# Altium schematic sheet MIcroSD_Card.SchDoc
size A4; SheetNumber: 5; SheetTotal: 14
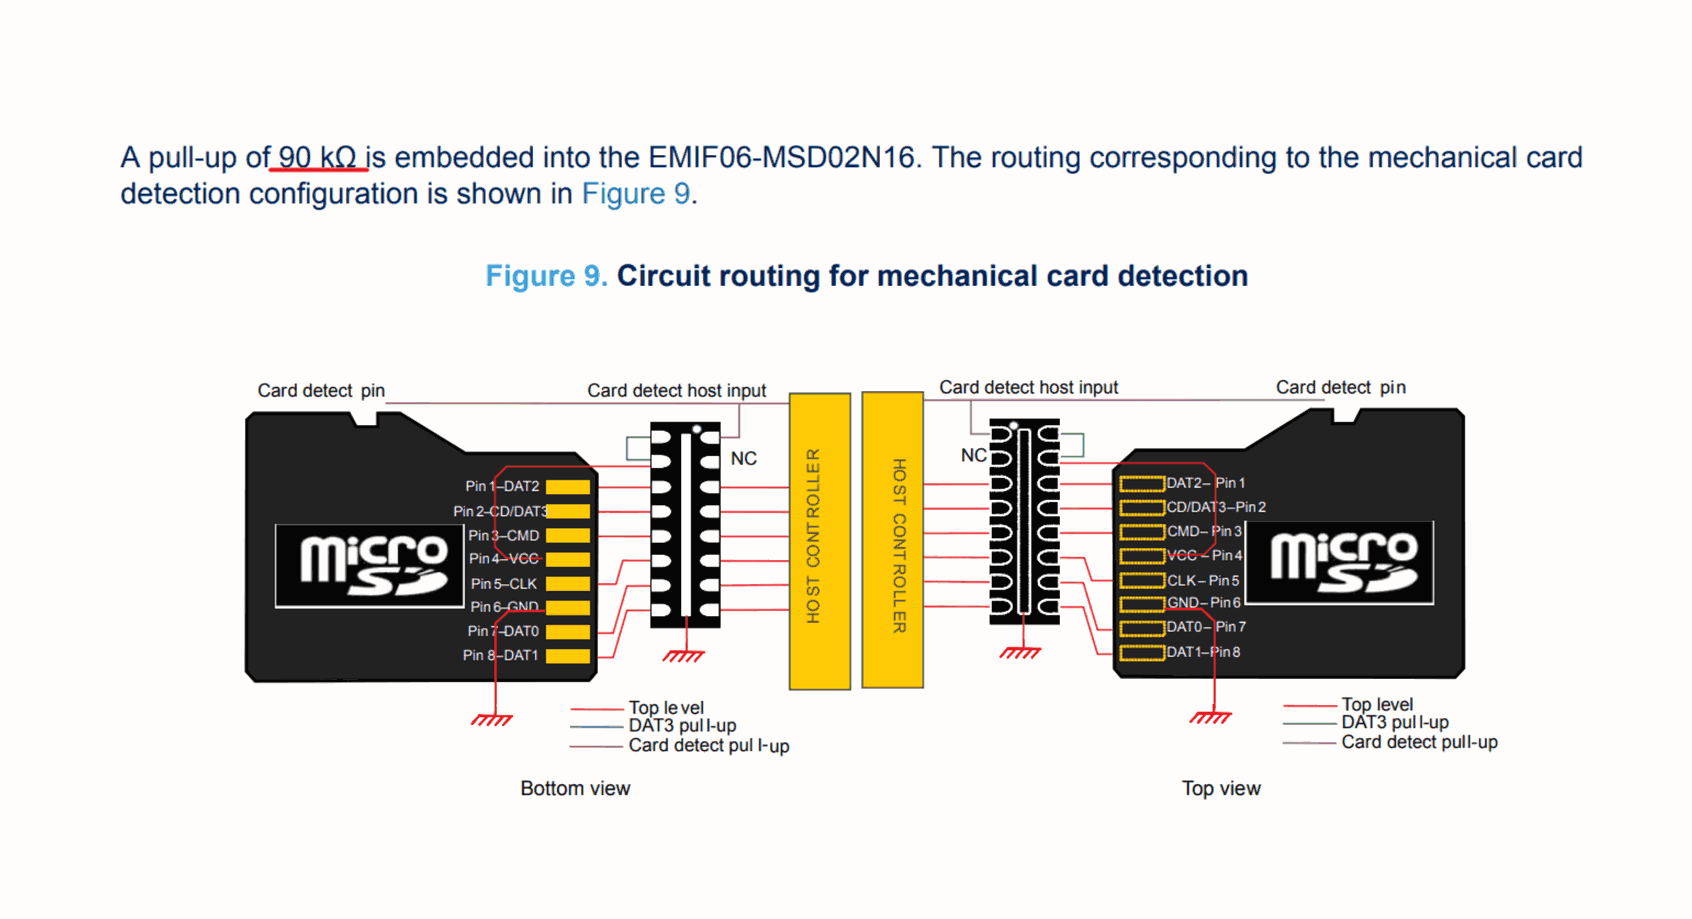
[diagram p0: MIcroSD_Card.SchDoc, top left]
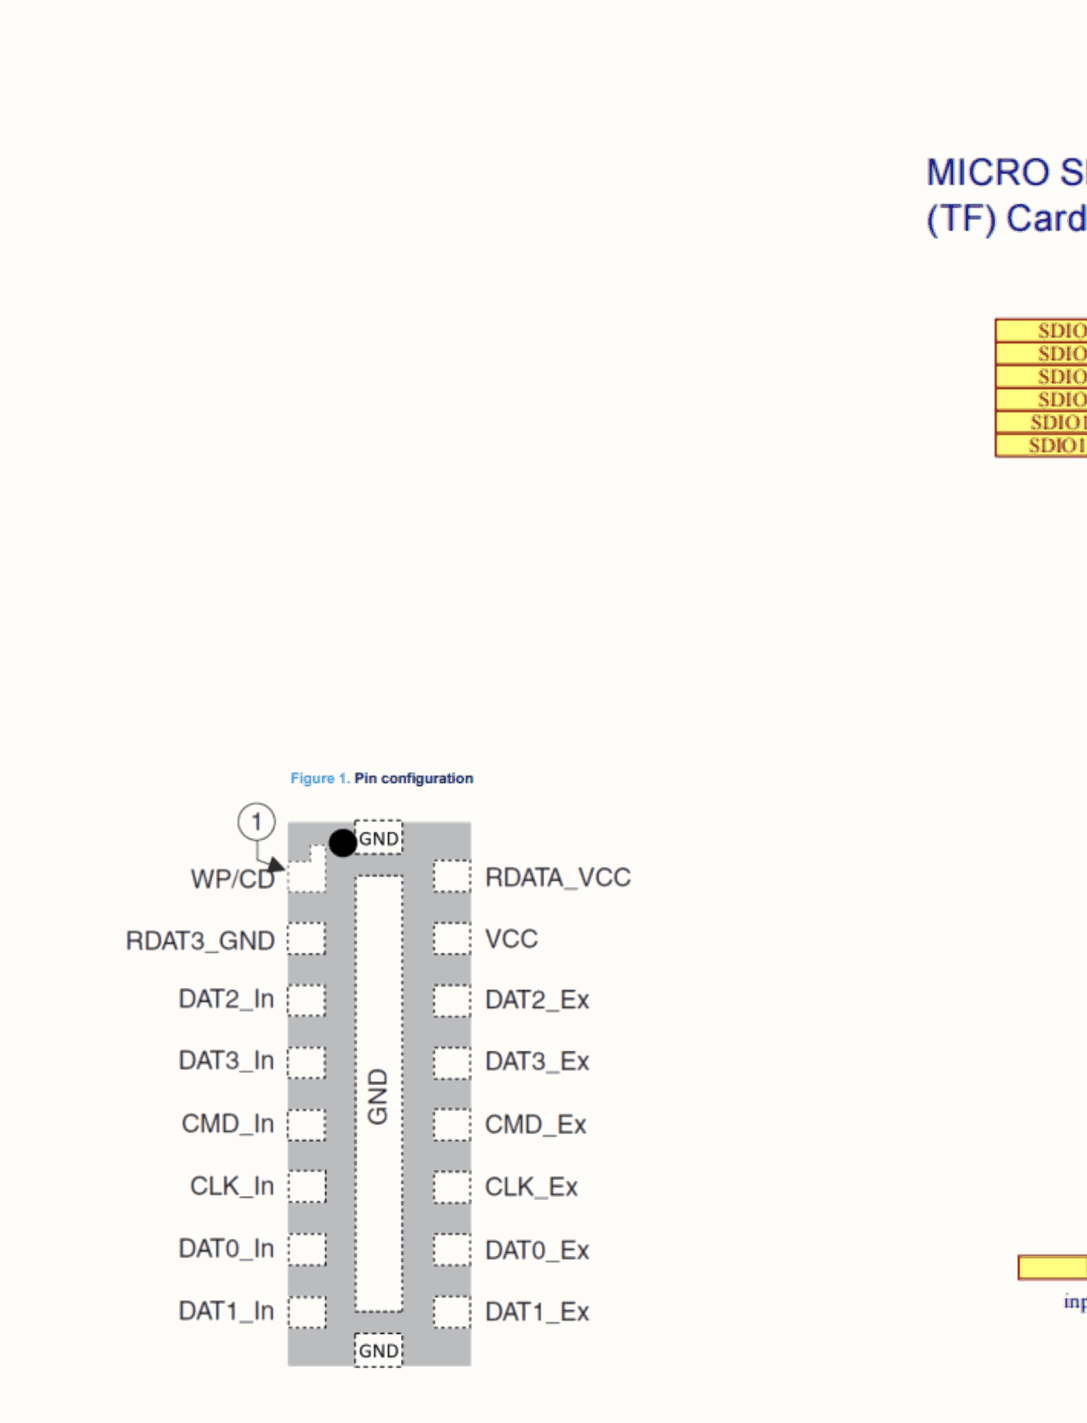
[diagram p1: MIcroSD_Card.SchDoc, top middle]
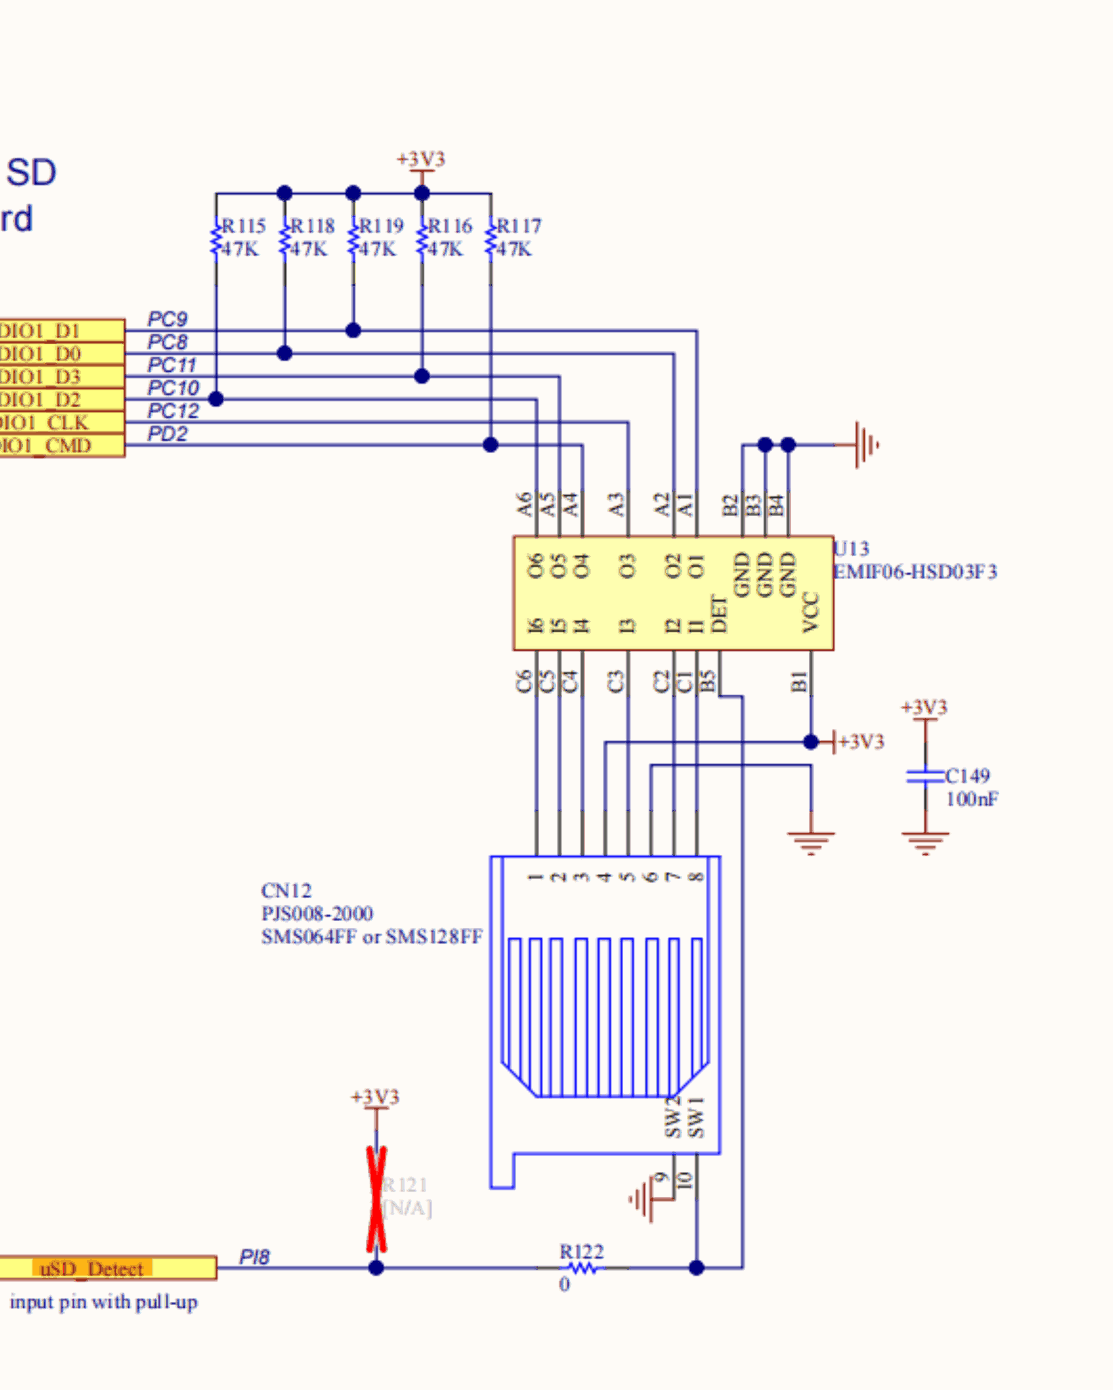
[diagram p2: MIcroSD_Card.SchDoc, top right]
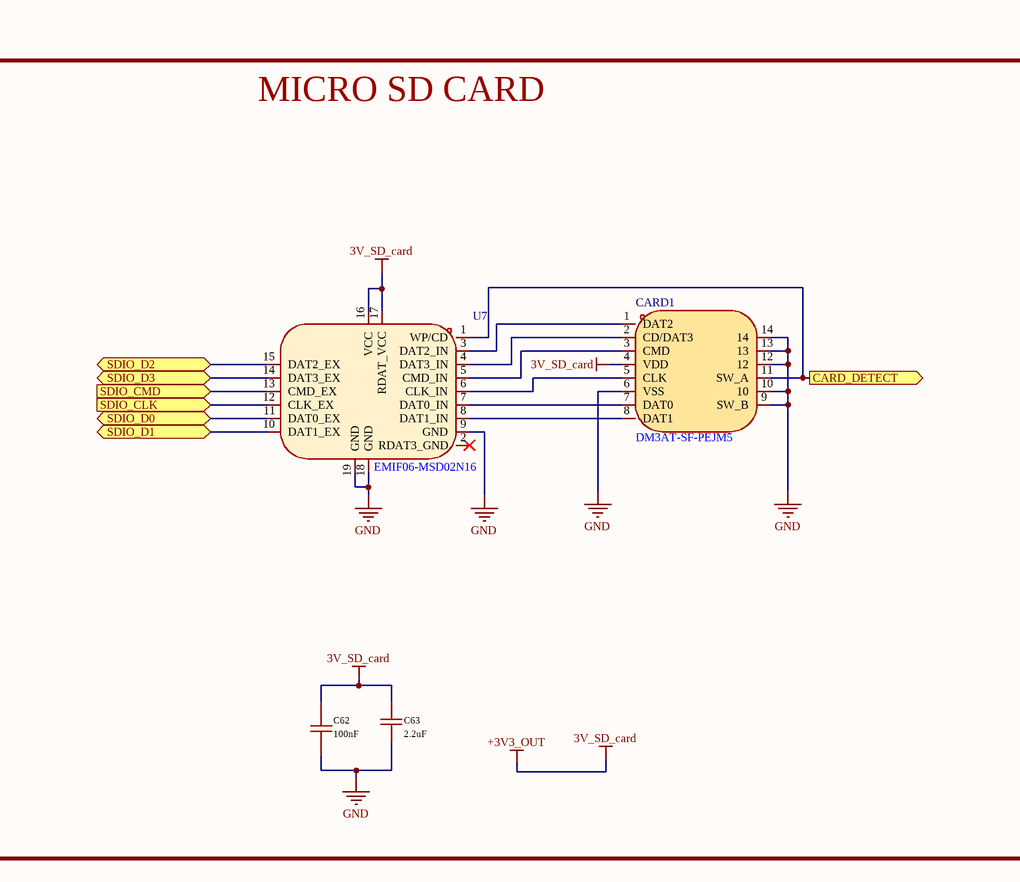
[diagram p3: MIcroSD_Card.SchDoc, bottom left]
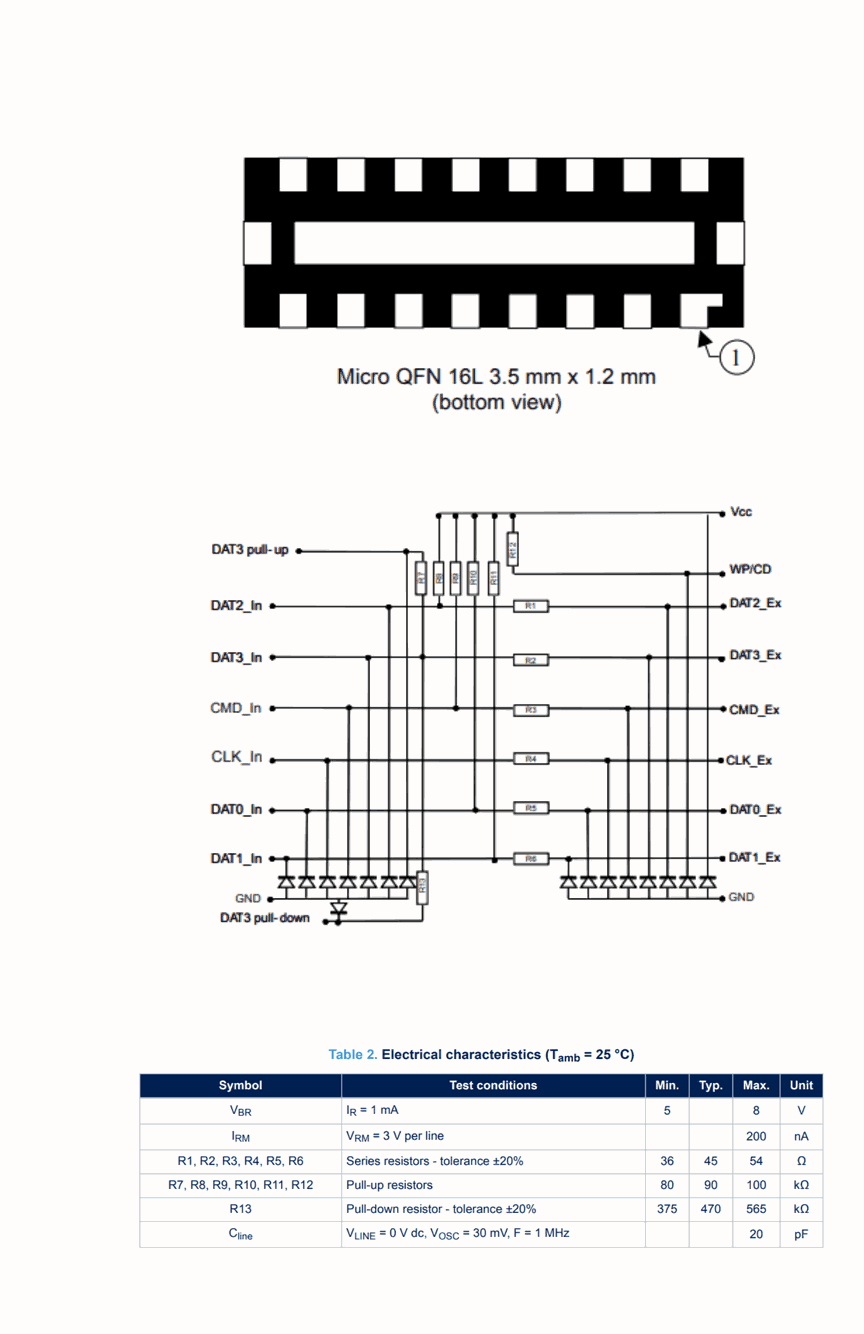
[diagram p4: MIcroSD_Card.SchDoc, bottom middle]
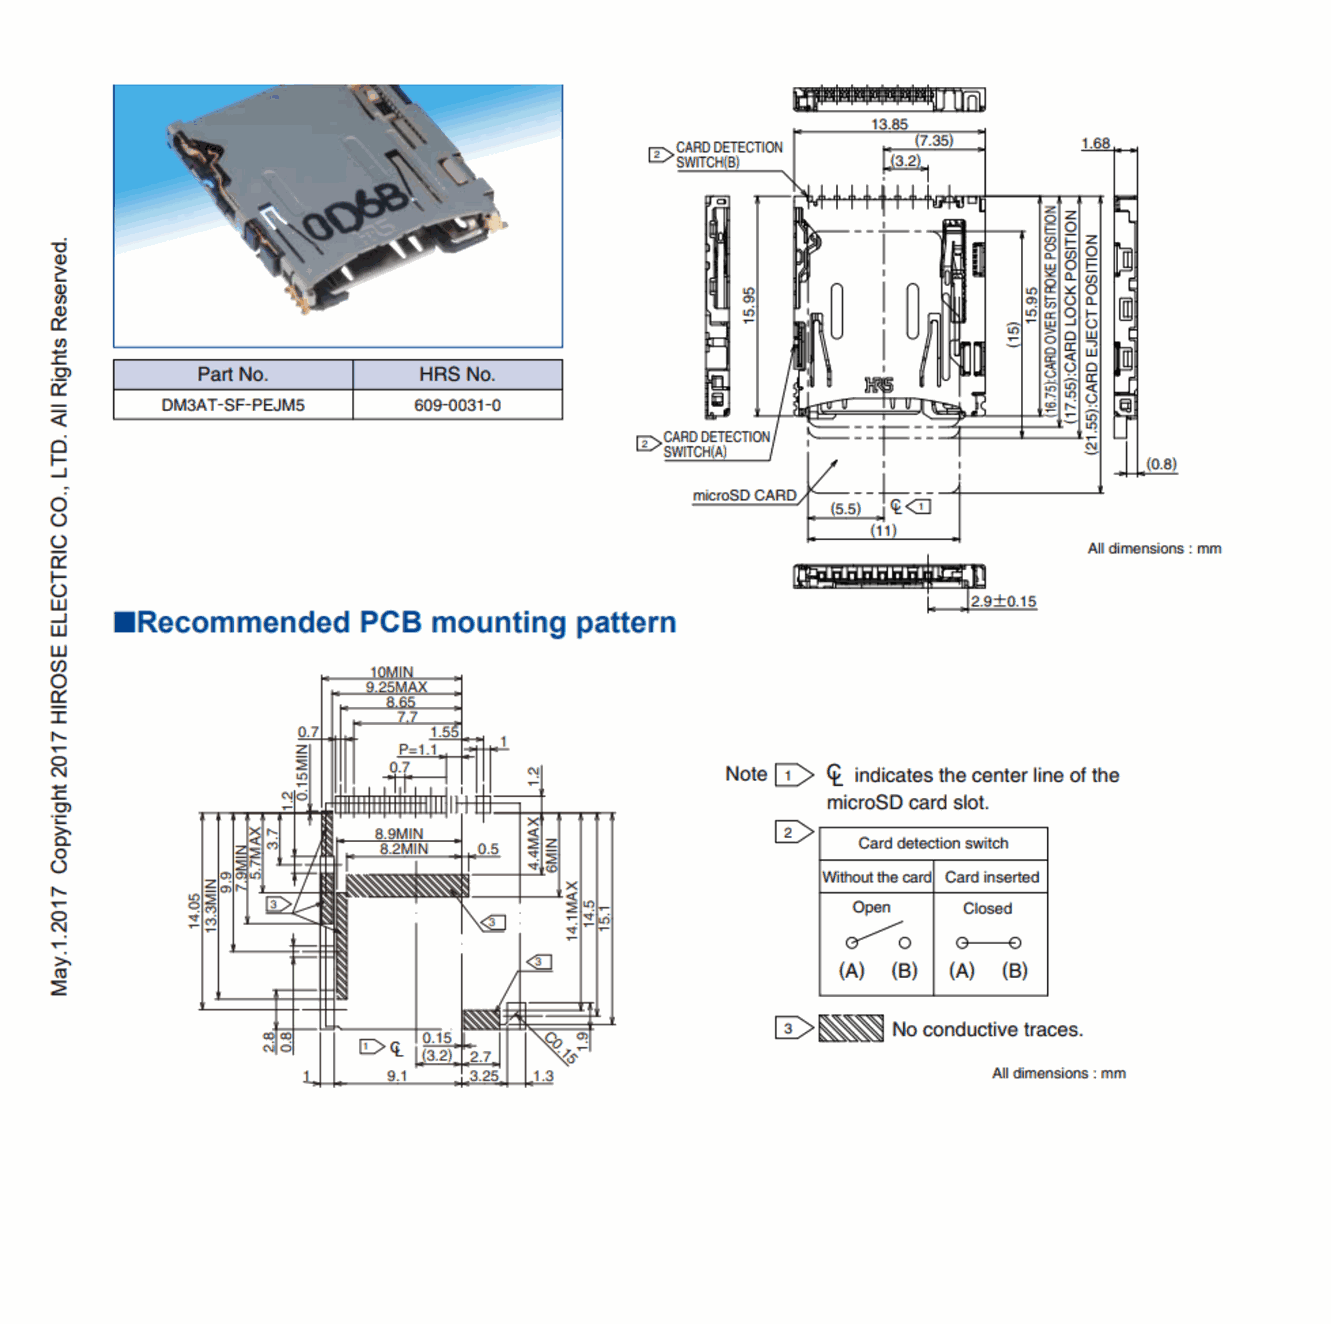
[diagram p5: MIcroSD_Card.SchDoc, bottom right]

## Parts
C62  100nF  [C_0603]
C63  2.2uF  [C_0805]
CARD1  DM3AT-SF-PEJM5  [SD-SMD_DM3AT-SF-PEJM5]
U7  EMIF06-MSD02N16  [QFN-16L_L3.5-W1.2-P0.40_EMIF06-MSD02N16]

## Blocks framed on the sheet
MICRO SD CARD: C62 C63 CARD1 U7

## Ports
CARD_DETECT (out), SDIO_CLK (in), SDIO_CMD (in), SDIO_D0 (bidir), SDIO_D1 (bidir), SDIO_D2 (bidir), SDIO_D3 (bidir)

## Nets
+3V3_OUT: C62.1 C63.2 CARD1.4(VDD) U7.16(VCC) U7.17(RDAT_VCC)  [also labelled 3V_SD_card]
GND: C62.2 C63.1 CARD1.6(VSS) CARD1.9(SW_B) CARD1.10 CARD1.12 CARD1.13 CARD1.14 U7.9(GND) U7.18(GND) U7.19(GND)
CARD_DETECT: CARD1.11(SW_A) U7.1(WP/CD) ; port CARD_DETECT
SDIO_CLK: U7.12(CLK_EX) ; port SDIO_CLK
SDIO_CMD: U7.13(CMD_EX) ; port SDIO_CMD
SDIO_D0: U7.11(DAT0_EX) ; port SDIO_D0
SDIO_D1: U7.10(DAT1_EX) ; port SDIO_D1
SDIO_D2: U7.15(DAT2_EX) ; port SDIO_D2
SDIO_D3: U7.14(DAT3_EX) ; port SDIO_D3
NetCARD1_1: CARD1.1(DAT2) U7.3(DAT2_IN)
NetCARD1_2: CARD1.2(CD/DAT3) U7.4(DAT3_IN)
NetCARD1_3: CARD1.3(CMD) U7.5(CMD_IN)
NetCARD1_5: CARD1.5(CLK) U7.6(CLK_IN)
NetCARD1_7: CARD1.7(DAT0) U7.7(DAT0_IN)
NetCARD1_8: CARD1.8(DAT1) U7.8(DAT1_IN)

Not connected (* = marked no-connect by the designer): U7 2(RDAT3_GND)*

## Notes on the sheet
- Project Name:
- Size:
- Date:
- A4
- Version:
- Time:
- V1.4.0.0
- Sheet:
- Of
- File:

## Library data of the parts
C62 = CC0603KRX7R9BB104: Manufacturer: YAGEO(国巨); Add into BOM: yes; Tolerance: ±10%; Voltage Rating: 50V; Temperature Coefficient: X7R; Symbol: CC0603KRX7R9BB104; Device: CC0603KRX7R9BB104; LCSC Part Name: 100nF ±10% 50V; Supplier Part: C14663; Manufacturer Part: CC0603KRX7R9BB104; Supplier Footprint: 0603; JLCPCB Part Class: Basic Part; Datasheet: https://item.szlcsc.com/datasheet/CC0603KRX7R9BB104/15331.html; Supplier: LCSC; Convert to PCB: yes; Value: 100nF
C63 = CL21B225KAFNNNE: Manufacturer: SAMSUNG(三星); Add into BOM: yes; Tolerance: ±10%; Voltage Rating: 25V; Temperature Coefficient: X7R; Symbol: CL21B225KAFNNNE; Device: CL21B225KAFNNNE; LCSC Part Name: 2.2uF ±10% 25V; Supplier Part: C19110; Manufacturer Part: CL21B225KAFNNNE; Supplier Footprint: 0805; JLCPCB Part Class: Extended Part; Datasheet: https://item.szlcsc.com/datasheet/CL21B225KAFNNNE/19814.html; Supplier: LCSC; Convert to PCB: yes; Value: 2.2uF
CARD1 = DM3AT-SF-PEJM5: Manufacturer: HRS(广濑); Add into BOM: yes; Card Connection Mode: Self-bouncing; Card Type: MicroSD card (TF card); Connector Type: Card Slot; Additional Card Detection Pins: None; Maximum Body Height: 1.68mm; Symbol: DM3AT-SF-PEJM5; Device: DM3AT-SF-PEJM5; LCSC Part Name: 自弹式 MicroSD卡(TF卡) 卡座; Supplier Part: C114218; Manufacturer Part: DM3AT-SF-PEJM5; Supplier Footprint: SMD; JLCPCB Part Class: Extended Part; Datasheet: https://atta.szlcsc.com/upload/public/pdf/source/20170707/1499425911622.pdf; Supplier: LCSC; Convert to PCB: yes; Supplementary Features: -; Operating Temperature Range: -25℃~+85℃
U7 = EMIF06-MSD02N16: Manufacturer: ST(意法半导体); Add into BOM: yes; Symbol: EMIF06-MSD02N 16; Device: EMIF06-MSD02N16; LCSC Part Name: EMIF06-MSD02N16; Supplier Part: C5267594; Manufacturer Part: EMIF06-MSD02N16; Supplier Footprint: QFN-16L; JLCPCB Part Class: Extended Part; Datasheet: https://atta.szlcsc.com/upload/public/pdf/source/20230906/AB780163D3E87C06B3836FCBE42EA0F7.pdf; Supplier: LCSC; Convert to PCB: yes